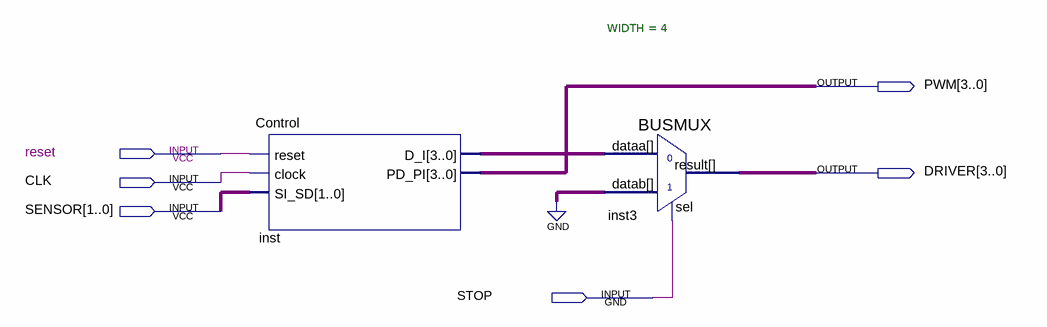
[diagram p0: schematic sheet]
// Quartus schematic Control.bdf as structural Verilog: 2 symbols, 6 pins
module Control (
  input  reset,
  input  CLK,
  input  [1:0] SENSOR,
  input  STOP,
  output [3:0] PWM,
  output [3:0] DRIVER
);

  wire [3:0] inst_d_i;

  Control inst (.reset(reset), .clock(CLK), .SI_SD(SENSOR), .D_I(inst_d_i), .PD_PI(PWM));
  BUSMUX #(.WIDTH(4)) inst3 (.datab(4'b0000), .sel(STOP), .dataa(inst_d_i), .result(DRIVER));
endmodule
